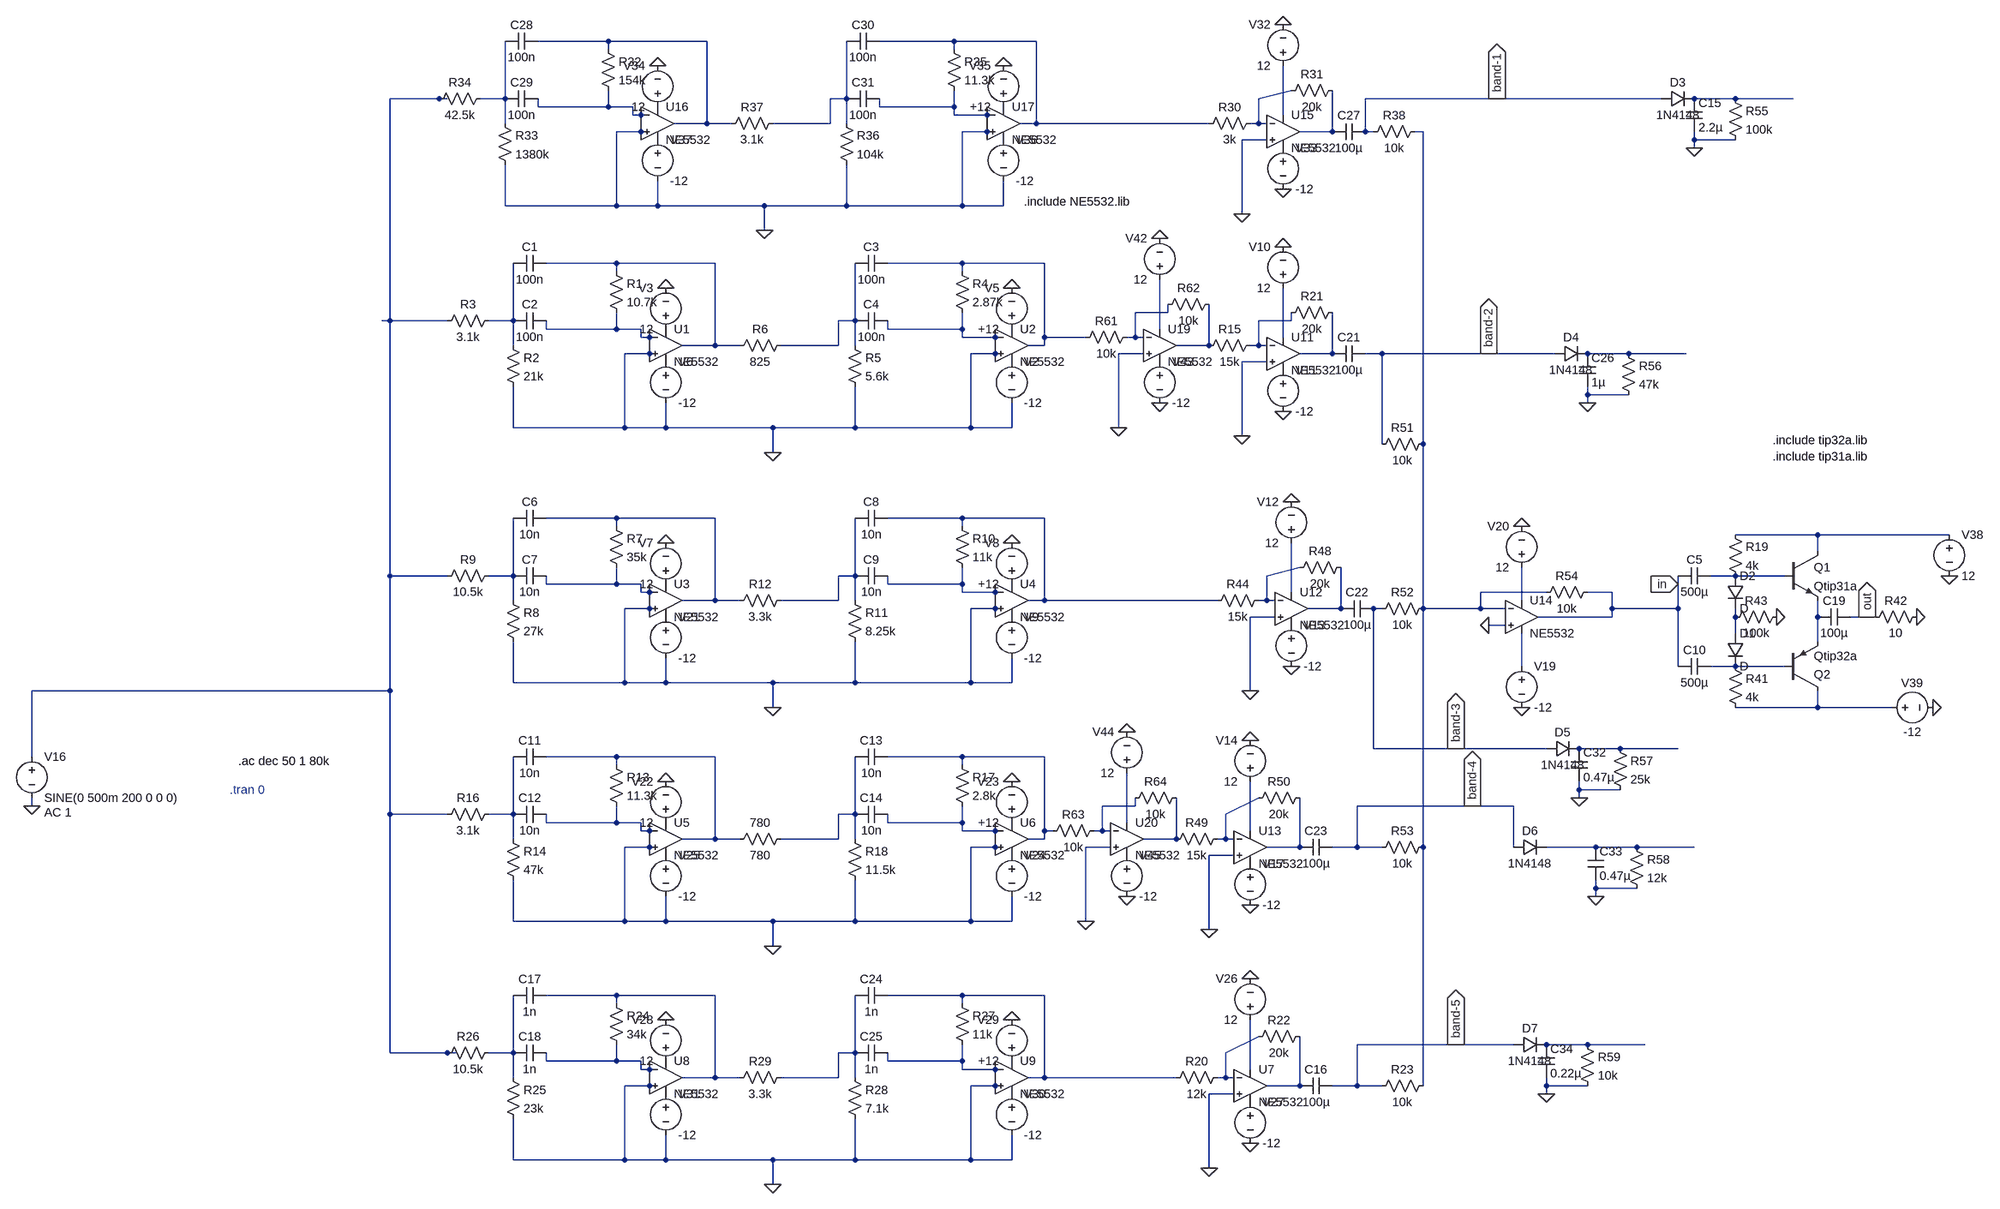
[diagram p0: schematic Equalizer 5.asc]
Equalizer 5.asc, the LTspice schematic file:
Version 4
SHEET 1 2712 2088
WIRE 16 -176 -144 -176
WIRE 208 -176 16 -176
WIRE 704 -176 544 -176
WIRE 864 -176 704 -176
WIRE 16 -160 16 -176
WIRE 704 -160 704 -176
WIRE -336 -64 -432 -64
WIRE -320 -64 -336 -64
WIRE -208 -64 -208 -176
WIRE -208 -64 -256 -64
WIRE 480 -64 480 -176
WIRE 480 -64 448 -64
WIRE 1296 -64 1360 -80
WIRE 1760 -64 1504 -64
WIRE 2080 -64 1760 -64
WIRE 2224 -64 2144 -64
WIRE 2336 -64 2224 -64
WIRE -144 -48 -144 -64
WIRE 16 -48 16 -80
WIRE 16 -48 -144 -48
WIRE 64 -48 16 -48
WIRE 544 -48 544 -64
WIRE 704 -48 704 -80
WIRE 704 -48 544 -48
WIRE 64 -32 64 -48
WIRE 80 -32 80 -48
WIRE 80 -32 64 -32
WIRE 96 -32 80 -32
WIRE 704 -32 704 -48
WIRE 768 -32 768 -48
WIRE 768 -32 704 -32
WIRE 784 -32 768 -32
WIRE 1344 -32 1344 -128
WIRE -208 -16 -208 -64
WIRE 208 -16 208 -176
WIRE 208 -16 144 -16
WIRE 256 -16 208 -16
WIRE 448 -16 448 -64
WIRE 448 -16 336 -16
WIRE 480 -16 480 -64
WIRE 864 -16 864 -176
WIRE 864 -16 832 -16
WIRE 1200 -16 864 -16
WIRE 1296 -16 1296 -64
WIRE 1296 -16 1280 -16
WIRE 1312 -16 1296 -16
WIRE 80 0 32 0
WIRE 96 0 80 0
WIRE 768 0 720 0
WIRE 784 0 768 0
WIRE 1440 0 1440 -80
WIRE 1440 0 1376 0
WIRE 1504 0 1504 -64
WIRE 1520 0 1504 0
WIRE 1616 0 1600 0
WIRE 1312 16 1264 16
WIRE 2144 16 2144 0
WIRE 2224 16 2144 16
WIRE 2144 32 2144 16
WIRE -208 144 -208 64
WIRE 32 144 32 0
WIRE 32 144 -208 144
WIRE 112 144 112 96
WIRE 112 144 32 144
WIRE 320 144 112 144
WIRE 480 144 480 64
WIRE 480 144 320 144
WIRE 720 144 720 0
WIRE 720 144 480 144
WIRE 800 144 800 96
WIRE 800 144 720 144
WIRE 1264 160 1264 16
WIRE 320 192 320 144
WIRE 32 256 -128 256
WIRE 224 256 32 256
WIRE 720 256 560 256
WIRE 880 256 720 256
WIRE 32 272 32 256
WIRE 720 272 720 256
WIRE 1120 352 1120 336
WIRE 1120 352 1056 352
WIRE -432 368 -432 -64
WIRE -432 368 -448 368
WIRE -320 368 -432 368
WIRE -192 368 -192 256
WIRE -192 368 -240 368
WIRE 496 368 496 256
WIRE 496 368 464 368
WIRE 1360 368 1360 352
WIRE 1360 368 1296 368
WIRE -128 384 -128 368
WIRE 32 384 32 352
WIRE 32 384 -128 384
WIRE 80 384 32 384
WIRE 560 384 560 368
WIRE 720 384 720 352
WIRE 720 384 560 384
WIRE 1104 384 1104 288
WIRE 80 400 80 384
WIRE 96 400 96 384
WIRE 96 400 80 400
WIRE 112 400 96 400
WIRE 720 400 720 384
WIRE 784 400 784 384
WIRE 784 400 720 400
WIRE 800 400 784 400
WIRE 880 400 880 256
WIRE 960 400 880 400
WIRE 1056 400 1056 352
WIRE 1056 400 1040 400
WIRE 1072 400 1056 400
WIRE 1344 400 1344 304
WIRE -192 416 -192 368
WIRE 224 416 224 256
WIRE 224 416 160 416
WIRE 272 416 224 416
WIRE 464 416 464 368
WIRE 464 416 352 416
WIRE 496 416 496 368
WIRE 880 416 880 400
WIRE 880 416 848 416
WIRE 1200 416 1200 336
WIRE 1200 416 1136 416
WIRE 1296 416 1296 368
WIRE 1296 416 1280 416
WIRE 1312 416 1296 416
WIRE 96 432 48 432
WIRE 112 432 96 432
WIRE 784 432 736 432
WIRE 800 432 784 432
WIRE 1072 432 1024 432
WIRE 1440 432 1440 352
WIRE 1440 432 1376 432
WIRE 1536 432 1504 432
WIRE 1744 432 1536 432
WIRE 1872 432 1744 432
WIRE 2016 432 1936 432
WIRE 2128 432 2016 432
WIRE 1312 448 1264 448
WIRE 1936 512 1936 496
WIRE 2016 512 1936 512
WIRE 1936 528 1936 512
WIRE -192 576 -192 496
WIRE 48 576 48 432
WIRE 48 576 -192 576
WIRE 128 576 128 528
WIRE 128 576 48 576
WIRE 336 576 128 576
WIRE 496 576 496 496
WIRE 496 576 336 576
WIRE 736 576 736 432
WIRE 736 576 496 576
WIRE 816 576 816 528
WIRE 816 576 736 576
WIRE 1024 576 1024 432
WIRE 1264 592 1264 448
WIRE 1536 608 1536 432
WIRE 1616 608 1616 0
WIRE 336 624 336 576
WIRE 32 752 -128 752
WIRE 224 752 32 752
WIRE 720 752 560 752
WIRE 880 752 720 752
WIRE 32 768 32 752
WIRE 720 768 720 752
WIRE 2384 784 2224 784
WIRE 2640 784 2384 784
WIRE 2384 816 2384 784
WIRE -432 864 -432 368
WIRE -320 864 -432 864
WIRE -192 864 -192 752
WIRE -192 864 -240 864
WIRE 496 864 496 752
WIRE 496 864 464 864
WIRE 1312 864 1376 848
WIRE 2224 864 2176 864
WIRE 2320 864 2224 864
WIRE -128 880 -128 864
WIRE 32 880 32 848
WIRE 32 880 -128 880
WIRE 80 880 32 880
WIRE 560 880 560 864
WIRE 720 880 720 848
WIRE 720 880 560 880
WIRE 2112 880 2112 864
WIRE 80 896 80 880
WIRE 96 896 96 880
WIRE 96 896 80 896
WIRE 112 896 96 896
WIRE 720 896 720 880
WIRE 784 896 784 880
WIRE 784 896 720 896
WIRE 800 896 784 896
WIRE 1360 896 1360 800
WIRE 1856 896 1728 896
WIRE 1984 896 1936 896
WIRE -192 912 -192 864
WIRE 224 912 224 752
WIRE 224 912 160 912
WIRE 272 912 224 912
WIRE 464 912 464 864
WIRE 464 912 352 912
WIRE 496 912 496 864
WIRE 880 912 880 752
WIRE 880 912 848 912
WIRE 1216 912 880 912
WIRE 1312 912 1312 864
WIRE 1312 912 1296 912
WIRE 1328 912 1312 912
WIRE 1808 912 1808 848
WIRE 96 928 48 928
WIRE 112 928 96 928
WIRE 784 928 736 928
WIRE 800 928 784 928
WIRE 1456 928 1456 848
WIRE 1456 928 1392 928
WIRE 1536 928 1520 928
WIRE 1616 928 1616 608
WIRE 1728 928 1728 896
WIRE 1728 928 1616 928
WIRE 1776 928 1728 928
WIRE 1984 928 1984 896
WIRE 2112 928 2112 880
WIRE 2112 928 1984 928
WIRE 1328 944 1280 944
WIRE 1984 944 1984 928
WIRE 1984 944 1840 944
WIRE 2224 944 2224 928
WIRE 2384 944 2384 912
WIRE 2480 944 2448 944
WIRE 2496 944 2480 944
WIRE 1776 960 1744 960
WIRE 2224 976 2224 944
WIRE 2384 992 2384 944
WIRE 1808 1040 1808 976
WIRE 2112 1040 2112 928
WIRE 2224 1040 2176 1040
WIRE 2320 1040 2224 1040
WIRE -192 1072 -192 992
WIRE 48 1072 48 928
WIRE 48 1072 -192 1072
WIRE 128 1072 128 1024
WIRE 128 1072 48 1072
WIRE 336 1072 128 1072
WIRE 496 1072 496 992
WIRE 496 1072 336 1072
WIRE 736 1072 736 928
WIRE 736 1072 496 1072
WIRE 816 1072 816 1024
WIRE 816 1072 736 1072
WIRE -432 1088 -432 864
WIRE -432 1088 -1392 1088
WIRE 1280 1088 1280 944
WIRE 336 1120 336 1072
WIRE 2384 1120 2384 1088
WIRE 2384 1120 2224 1120
WIRE 2528 1120 2384 1120
WIRE 1520 1200 1520 928
WIRE 1680 1200 1520 1200
WIRE 1856 1200 1680 1200
WIRE 2000 1200 1920 1200
WIRE 2112 1200 2000 1200
WIRE -1392 1216 -1392 1088
WIRE 32 1216 -128 1216
WIRE 224 1216 32 1216
WIRE 720 1216 560 1216
WIRE 880 1216 720 1216
WIRE 32 1232 32 1216
WIRE 720 1232 720 1216
WIRE 1920 1280 1920 1264
WIRE 2000 1280 1920 1280
WIRE 1920 1296 1920 1280
WIRE -1392 1312 -1392 1296
WIRE 1056 1312 1056 1296
WIRE 1056 1312 992 1312
WIRE 1712 1312 1488 1312
WIRE 1792 1312 1712 1312
WIRE -432 1328 -432 1088
WIRE -320 1328 -432 1328
WIRE -192 1328 -192 1216
WIRE -192 1328 -240 1328
WIRE 496 1328 496 1216
WIRE 496 1328 464 1328
WIRE 1232 1328 1296 1296
WIRE -128 1344 -128 1328
WIRE 32 1344 32 1312
WIRE 32 1344 -128 1344
WIRE 80 1344 32 1344
WIRE 560 1344 560 1328
WIRE 720 1344 720 1312
WIRE 720 1344 560 1344
WIRE 1040 1344 1040 1248
WIRE 80 1360 80 1344
WIRE 96 1360 96 1344
WIRE 96 1360 80 1360
WIRE 112 1360 96 1360
WIRE 720 1360 720 1344
WIRE 784 1360 784 1344
WIRE 784 1360 720 1360
WIRE 800 1360 784 1360
WIRE 880 1360 880 1216
WIRE 896 1360 880 1360
WIRE 992 1360 992 1312
WIRE 992 1360 976 1360
WIRE 1008 1360 992 1360
WIRE 1280 1360 1280 1264
WIRE -192 1376 -192 1328
WIRE 224 1376 224 1216
WIRE 224 1376 160 1376
WIRE 272 1376 224 1376
WIRE 464 1376 464 1328
WIRE 464 1376 352 1376
WIRE 496 1376 496 1328
WIRE 880 1376 880 1360
WIRE 880 1376 848 1376
WIRE 1136 1376 1136 1296
WIRE 1136 1376 1072 1376
WIRE 1232 1376 1232 1328
WIRE 1232 1376 1216 1376
WIRE 1248 1376 1232 1376
WIRE 96 1392 48 1392
WIRE 112 1392 96 1392
WIRE 784 1392 736 1392
WIRE 800 1392 784 1392
WIRE 1008 1392 960 1392
WIRE 1376 1392 1376 1296
WIRE 1376 1392 1312 1392
WIRE 1488 1392 1488 1312
WIRE 1488 1392 1440 1392
WIRE 1536 1392 1488 1392
WIRE 1616 1392 1616 928
WIRE 1792 1392 1792 1312
WIRE 1952 1392 1856 1392
WIRE 2032 1392 1952 1392
WIRE 2144 1392 2032 1392
WIRE 1248 1408 1200 1408
WIRE 1952 1472 1952 1456
WIRE 2032 1472 1952 1472
WIRE 1952 1488 1952 1472
WIRE -192 1536 -192 1456
WIRE 48 1536 48 1392
WIRE 48 1536 -192 1536
WIRE 128 1536 128 1488
WIRE 128 1536 48 1536
WIRE 336 1536 128 1536
WIRE 496 1536 496 1456
WIRE 496 1536 336 1536
WIRE 736 1536 736 1392
WIRE 736 1536 496 1536
WIRE 816 1536 816 1488
WIRE 816 1536 736 1536
WIRE 960 1536 960 1392
WIRE 1200 1552 1200 1408
WIRE 336 1584 336 1536
WIRE 32 1680 -128 1680
WIRE 224 1680 32 1680
WIRE 720 1680 560 1680
WIRE 880 1680 720 1680
WIRE 32 1696 32 1680
WIRE 720 1696 720 1680
WIRE 1680 1776 1488 1776
WIRE 1792 1776 1680 1776
WIRE 1936 1776 1856 1776
WIRE 2048 1776 1936 1776
WIRE -432 1792 -432 1328
WIRE -320 1792 -432 1792
WIRE -304 1792 -320 1792
WIRE -192 1792 -192 1680
WIRE -192 1792 -240 1792
WIRE 496 1792 496 1680
WIRE 496 1792 464 1792
WIRE 1232 1792 1296 1760
WIRE -128 1808 -128 1792
WIRE 32 1808 32 1776
WIRE 32 1808 -128 1808
WIRE 80 1808 32 1808
WIRE 560 1808 560 1792
WIRE 720 1808 720 1776
WIRE 720 1808 560 1808
WIRE 80 1824 80 1808
WIRE 96 1824 96 1808
WIRE 96 1824 80 1824
WIRE 112 1824 96 1824
WIRE 720 1824 720 1808
WIRE 784 1824 784 1808
WIRE 784 1824 720 1824
WIRE 800 1824 784 1824
WIRE 1280 1824 1280 1728
WIRE -192 1840 -192 1792
WIRE 224 1840 224 1680
WIRE 224 1840 160 1840
WIRE 272 1840 224 1840
WIRE 464 1840 464 1792
WIRE 464 1840 352 1840
WIRE 496 1840 496 1792
WIRE 880 1840 880 1680
WIRE 880 1840 848 1840
WIRE 1136 1840 880 1840
WIRE 1232 1840 1232 1792
WIRE 1232 1840 1216 1840
WIRE 1248 1840 1232 1840
WIRE 96 1856 48 1856
WIRE 112 1856 96 1856
WIRE 784 1856 736 1856
WIRE 800 1856 784 1856
WIRE 1376 1856 1376 1760
WIRE 1376 1856 1312 1856
WIRE 1488 1856 1488 1776
WIRE 1488 1856 1440 1856
WIRE 1536 1856 1488 1856
WIRE 1616 1856 1616 1392
WIRE 1856 1856 1856 1840
WIRE 1936 1856 1856 1856
WIRE 1248 1872 1200 1872
WIRE 1856 1872 1856 1856
WIRE -192 2000 -192 1920
WIRE 48 2000 48 1856
WIRE 48 2000 -192 2000
WIRE 128 2000 128 1952
WIRE 128 2000 48 2000
WIRE 336 2000 128 2000
WIRE 496 2000 496 1920
WIRE 496 2000 336 2000
WIRE 736 2000 736 1856
WIRE 736 2000 496 2000
WIRE 816 2000 816 1952
WIRE 816 2000 736 2000
WIRE 1200 2016 1200 1872
WIRE 336 2048 336 2000
FLAG -1392 1312 0
FLAG 1264 592 0
FLAG 1344 544 0
FLAG 1344 224 0
FLAG 1280 1088 0
FLAG 1360 1040 0
FLAG 1360 720 0
FLAG 1200 1552 0
FLAG 1280 1504 0
FLAG 1280 1184 0
FLAG 1808 1120 0
FLAG 1808 768 0
FLAG 1744 960 0
FLAG 336 624 0
FLAG 128 304 0
FLAG 816 304 0
FLAG 336 1120 0
FLAG 128 800 0
FLAG 816 800 0
FLAG 336 1584 0
FLAG 128 1264 0
FLAG 816 1264 0
FLAG 1200 2016 0
FLAG 1280 1968 0
FLAG 1280 1648 0
FLAG 336 2048 0
FLAG 128 1728 0
FLAG 816 1728 0
FLAG 1264 160 0
FLAG 1344 112 0
FLAG 1344 -208 0
FLAG 320 192 0
FLAG 112 -128 0
FLAG 800 -128 0
FLAG 2640 864 0
FLAG 2608 1120 0
FLAG 2304 944 0
FLAG 2576 944 0
FLAG 2112 880 in
IOPIN 2112 880 In
FLAG 2480 944 out
IOPIN 2480 944 Out
FLAG 2144 32 0
FLAG 1936 528 0
FLAG 1920 1296 0
FLAG 1952 1488 0
FLAG 1856 1872 0
FLAG 1024 576 0
FLAG 1104 528 0
FLAG 1104 208 0
FLAG 960 1536 0
FLAG 1040 1488 0
FLAG 1040 1168 0
FLAG 1760 -64 band-1
IOPIN 1760 -64 Out
FLAG 1744 432 band-2
IOPIN 1744 432 Out
FLAG 1680 1200 band-3
IOPIN 1680 1200 Out
FLAG 1712 1312 band-4
IOPIN 1712 1312 Out
FLAG 1680 1776 band-5
IOPIN 1680 1776 Out
SYMBOL voltage -1392 1200 R0
WINDOW 123 24 124 Left 2
WINDOW 39 0 0 Left 0
SYMATTR Value2 AC 1
SYMATTR InstName V16
SYMATTR Value SINE(0 500m 200 0 0 0)
SYMBOL res 1296 400 R90
WINDOW 0 0 56 VBottom 2
WINDOW 3 32 56 VTop 2
SYMATTR InstName R15
SYMATTR Value 15k
SYMBOL voltage 1344 320 R180
WINDOW 0 24 96 Left 2
WINDOW 3 24 16 Left 2
WINDOW 123 0 0 Left 0
WINDOW 39 0 0 Left 0
SYMATTR InstName V10
SYMATTR Value 12
SYMBOL voltage 1344 448 R0
WINDOW 123 0 0 Left 0
WINDOW 39 0 0 Left 0
SYMATTR InstName V11
SYMATTR Value -12
SYMBOL OpAmps\\opamp2 1344 368 R0
SYMATTR InstName U11
SYMATTR Value NE5532
SYMBOL res 1312 896 R90
WINDOW 0 0 56 VBottom 2
WINDOW 3 32 56 VTop 2
SYMATTR InstName R44
SYMATTR Value 15k
SYMBOL voltage 1360 816 R180
WINDOW 0 24 96 Left 2
WINDOW 3 24 16 Left 2
WINDOW 123 0 0 Left 0
WINDOW 39 0 0 Left 0
SYMATTR InstName V12
SYMATTR Value 12
SYMBOL voltage 1360 944 R0
WINDOW 123 0 0 Left 0
WINDOW 39 0 0 Left 0
SYMATTR InstName V13
SYMATTR Value -12
SYMBOL OpAmps\\opamp2 1360 864 R0
SYMATTR InstName U12
SYMATTR Value NE5532
SYMBOL res 1472 832 R90
WINDOW 0 0 56 VBottom 2
WINDOW 3 32 56 VTop 2
SYMATTR InstName R48
SYMATTR Value 20k
SYMBOL res 1232 1360 R90
WINDOW 0 0 56 VBottom 2
WINDOW 3 32 56 VTop 2
SYMATTR InstName R49
SYMATTR Value 15k
SYMBOL voltage 1280 1280 R180
WINDOW 0 24 96 Left 2
WINDOW 3 24 16 Left 2
WINDOW 123 0 0 Left 0
WINDOW 39 0 0 Left 0
SYMATTR InstName V14
SYMATTR Value 12
SYMBOL voltage 1280 1408 R0
WINDOW 123 0 0 Left 0
WINDOW 39 0 0 Left 0
SYMATTR InstName V17
SYMATTR Value -12
SYMBOL OpAmps\\opamp2 1280 1328 R0
SYMATTR InstName U13
SYMATTR Value NE5532
SYMBOL res 1392 1280 R90
WINDOW 0 0 56 VBottom 2
WINDOW 3 32 56 VTop 2
SYMATTR InstName R50
SYMATTR Value 20k
SYMBOL res 1456 336 R90
WINDOW 0 0 56 VBottom 2
WINDOW 3 32 56 VTop 2
SYMATTR InstName R21
SYMATTR Value 20k
SYMBOL cap 1504 416 R90
WINDOW 0 0 32 VBottom 2
WINDOW 3 32 32 VTop 2
SYMATTR InstName C21
SYMATTR Value 100µ
SYMBOL cap 1520 912 R90
WINDOW 0 0 32 VBottom 2
WINDOW 3 32 32 VTop 2
SYMATTR InstName C22
SYMATTR Value 100µ
SYMBOL cap 1440 1376 R90
WINDOW 0 0 32 VBottom 2
WINDOW 3 32 32 VTop 2
SYMATTR InstName C23
SYMATTR Value 100µ
SYMBOL res 1632 592 R90
WINDOW 0 0 56 VBottom 2
WINDOW 3 32 56 VTop 2
SYMATTR InstName R51
SYMATTR Value 10k
SYMBOL res 1632 912 R90
WINDOW 0 0 56 VBottom 2
WINDOW 3 32 56 VTop 2
SYMATTR InstName R52
SYMATTR Value 10k
SYMBOL res 1632 1376 R90
WINDOW 0 0 56 VBottom 2
WINDOW 3 32 56 VTop 2
SYMATTR InstName R53
SYMATTR Value 10k
SYMBOL OpAmps\\opamp2 1808 880 R0
SYMATTR InstName U14
SYMATTR Value NE5532
SYMBOL voltage 1808 1024 R0
WINDOW 123 0 0 Left 0
WINDOW 39 0 0 Left 0
SYMATTR InstName V19
SYMATTR Value -12
SYMBOL voltage 1808 864 R180
WINDOW 0 24 96 Left 2
WINDOW 3 24 16 Left 2
WINDOW 123 0 0 Left 0
WINDOW 39 0 0 Left 0
SYMATTR InstName V20
SYMATTR Value 12
SYMBOL res 1952 880 R90
WINDOW 0 0 56 VBottom 2
WINDOW 3 32 56 VTop 2
SYMATTR InstName R54
SYMATTR Value 10k
SYMBOL res 16 256 R0
SYMATTR InstName R1
SYMATTR Value 10.7k
SYMBOL cap -128 240 R90
WINDOW 0 0 32 VBottom 2
WINDOW 3 32 32 VTop 2
SYMATTR InstName C1
SYMATTR Value 100n
SYMBOL cap -128 352 R90
WINDOW 0 0 32 VBottom 2
WINDOW 3 32 32 VTop 2
SYMATTR InstName C2
SYMATTR Value 100n
SYMBOL res -208 400 R0
SYMATTR InstName R2
SYMATTR Value 21k
SYMBOL res 704 256 R0
SYMATTR InstName R4
SYMATTR Value 2.87k
SYMBOL cap 560 240 R90
WINDOW 0 0 32 VBottom 2
WINDOW 3 32 32 VTop 2
SYMATTR InstName C3
SYMATTR Value 100n
SYMBOL cap 560 352 R90
WINDOW 0 0 32 VBottom 2
WINDOW 3 32 32 VTop 2
SYMATTR InstName C4
SYMATTR Value 100n
SYMBOL res 480 400 R0
SYMATTR InstName R5
SYMATTR Value 5.6k
SYMBOL res 368 400 R90
WINDOW 0 0 56 VBottom 2
WINDOW 3 32 56 VTop 2
SYMATTR InstName R6
SYMATTR Value 825
SYMBOL voltage 128 400 R180
WINDOW 0 24 96 Left 2
WINDOW 3 24 16 Left 2
WINDOW 123 0 0 Left 0
WINDOW 39 0 0 Left 0
SYMATTR InstName V3
SYMATTR Value 12
SYMBOL voltage 816 400 R180
WINDOW 0 24 96 Left 2
WINDOW 3 24 16 Left 2
WINDOW 123 0 0 Left 0
WINDOW 39 24 68 Left 2
SYMATTR InstName V5
SYMATTR Value +12
SYMBOL OpAmps\\opamp2 128 352 R0
SYMATTR InstName U1
SYMATTR Value NE5532
SYMBOL OpAmps\\opamp2 816 352 R0
SYMATTR InstName U2
SYMATTR Value NE5532
SYMBOL voltage 816 432 R0
WINDOW 123 0 0 Left 0
WINDOW 39 0 0 Left 0
SYMATTR InstName V2
SYMATTR Value -12
SYMBOL voltage 128 432 R0
WINDOW 123 0 0 Left 0
WINDOW 39 0 0 Left 0
SYMATTR InstName V6
SYMATTR Value -12
SYMBOL res 16 752 R0
SYMATTR InstName R7
SYMATTR Value 35k
SYMBOL cap -128 736 R90
WINDOW 0 0 32 VBottom 2
WINDOW 3 32 32 VTop 2
SYMATTR InstName C6
SYMATTR Value 10n
SYMBOL cap -128 848 R90
WINDOW 0 0 32 VBottom 2
WINDOW 3 32 32 VTop 2
SYMATTR InstName C7
SYMATTR Value 10n
SYMBOL res -208 896 R0
SYMATTR InstName R8
SYMATTR Value 27k
SYMBOL res -224 848 R90
WINDOW 0 0 56 VBottom 2
WINDOW 3 32 56 VTop 2
SYMATTR InstName R9
SYMATTR Value 10.5k
SYMBOL res 704 752 R0
SYMATTR InstName R10
SYMATTR Value 11k
SYMBOL cap 560 736 R90
WINDOW 0 0 32 VBottom 2
WINDOW 3 32 32 VTop 2
SYMATTR InstName C8
SYMATTR Value 10n
SYMBOL cap 560 848 R90
WINDOW 0 0 32 VBottom 2
WINDOW 3 32 32 VTop 2
SYMATTR InstName C9
SYMATTR Value 10n
SYMBOL res 480 896 R0
SYMATTR InstName R11
SYMATTR Value 8.25k
SYMBOL res 368 896 R90
WINDOW 0 0 56 VBottom 2
WINDOW 3 32 56 VTop 2
SYMATTR InstName R12
SYMATTR Value 3.3k
SYMBOL voltage 128 896 R180
WINDOW 0 24 96 Left 2
WINDOW 3 24 16 Left 2
WINDOW 123 0 0 Left 0
WINDOW 39 0 0 Left 0
SYMATTR InstName V7
SYMATTR Value 12
SYMBOL voltage 816 896 R180
WINDOW 0 24 96 Left 2
WINDOW 3 24 16 Left 2
WINDOW 123 0 0 Left 0
WINDOW 39 24 68 Left 2
SYMATTR InstName V8
SYMATTR Value +12
SYMBOL OpAmps\\opamp2 128 848 R0
SYMATTR InstName U3
SYMATTR Value NE5532
SYMBOL OpAmps\\opamp2 816 848 R0
SYMATTR InstName U4
SYMATTR Value NE5532
SYMBOL voltage 816 928 R0
WINDOW 123 0 0 Left 0
WINDOW 39 0 0 Left 0
SYMATTR InstName V9
SYMATTR Value -12
SYMBOL voltage 128 928 R0
WINDOW 123 0 0 Left 0
WINDOW 39 0 0 Left 0
SYMATTR InstName V21
SYMATTR Value -12
SYMBOL res 16 1216 R0
SYMATTR InstName R13
SYMATTR Value 11.3k
SYMBOL cap -128 1200 R90
WINDOW 0 0 32 VBottom 2
WINDOW 3 32 32 VTop 2
SYMATTR InstName C11
SYMATTR Value 10n
SYMBOL cap -128 1312 R90
WINDOW 0 0 32 VBottom 2
WINDOW 3 32 32 VTop 2
SYMATTR InstName C12
SYMATTR Value 10n
SYMBOL res -208 1360 R0
SYMATTR InstName R14
SYMATTR Value 47k
SYMBOL res -224 1312 R90
WINDOW 0 0 56 VBottom 2
WINDOW 3 32 56 VTop 2
SYMATTR InstName R16
SYMATTR Value 3.1k
SYMBOL res 704 1216 R0
SYMATTR InstName R17
SYMATTR Value 2.8k
SYMBOL cap 560 1200 R90
WINDOW 0 0 32 VBottom 2
WINDOW 3 32 32 VTop 2
SYMATTR InstName C13
SYMATTR Value 10n
SYMBOL cap 560 1312 R90
WINDOW 0 0 32 VBottom 2
WINDOW 3 32 32 VTop 2
SYMATTR InstName C14
SYMATTR Value 10n
SYMBOL res 480 1360 R0
SYMATTR InstName R18
SYMATTR Value 11.5k
SYMBOL res 368 1360 R90
WINDOW 0 0 56 VBottom 2
WINDOW 3 32 56 VTop 2
SYMATTR InstName 780
SYMATTR Value 780
SYMBOL voltage 128 1360 R180
WINDOW 0 24 96 Left 2
WINDOW 3 24 16 Left 2
WINDOW 123 0 0 Left 0
WINDOW 39 0 0 Left 0
SYMATTR InstName V22
SYMATTR Value 12
SYMBOL voltage 816 1360 R180
WINDOW 0 24 96 Left 2
WINDOW 3 24 16 Left 2
WINDOW 123 0 0 Left 0
WINDOW 39 24 68 Left 2
SYMATTR InstName V23
SYMATTR Value +12
SYMBOL OpAmps\\opamp2 128 1312 R0
SYMATTR InstName U5
SYMATTR Value NE5532
SYMBOL OpAmps\\opamp2 816 1312 R0
SYMATTR InstName U6
SYMATTR Value NE5532
SYMBOL voltage 816 1392 R0
WINDOW 123 0 0 Left 0
WINDOW 39 0 0 Left 0
SYMATTR InstName V24
SYMATTR Value -12
SYMBOL voltage 128 1392 R0
WINDOW 123 0 0 Left 0
WINDOW 39 0 0 Left 0
SYMATTR InstName V25
SYMATTR Value -12
SYMBOL res 1232 1824 R90
WINDOW 0 0 56 VBottom 2
WINDOW 3 32 56 VTop 2
SYMATTR InstName R20
SYMATTR Value 12k
SYMBOL voltage 1280 1744 R180
WINDOW 0 24 96 Left 2
WINDOW 3 24 16 Left 2
WINDOW 123 0 0 Left 0
WINDOW 39 0 0 Left 0
SYMATTR InstName V26
SYMATTR Value 12
SYMBOL voltage 1280 1872 R0
WINDOW 123 0 0 Left 0
WINDOW 39 0 0 Left 0
SYMATTR InstName V27
SYMATTR Value -12
SYMBOL OpAmps\\opamp2 1280 1792 R0
SYMATTR InstName U7
SYMATTR Value NE5532
SYMBOL res 1392 1744 R90
WINDOW 0 0 56 VBottom 2
WINDOW 3 32 56 VTop 2
SYMATTR InstName R22
SYMATTR Value 20k
SYMBOL cap 1440 1840 R90
WINDOW 0 0 32 VBottom 2
WINDOW 3 32 32 VTop 2
SYMATTR InstName C16
SYMATTR Value 100µ
SYMBOL res 1632 1840 R90
WINDOW 0 0 56 VBottom 2
WINDOW 3 32 56 VTop 2
SYMATTR InstName R23
SYMATTR Value 10k
SYMBOL res 16 1680 R0
SYMATTR InstName R24
SYMATTR Value 34k
SYMBOL cap -128 1664 R90
WINDOW 0 0 32 VBottom 2
WINDOW 3 32 32 VTop 2
SYMATTR InstName C17
SYMATTR Value 1n
SYMBOL cap -128 1776 R90
WINDOW 0 0 32 VBottom 2
WINDOW 3 32 32 VTop 2
SYMATTR InstName C18
SYMATTR Value 1n
SYMBOL res -208 1824 R0
SYMATTR InstName R25
SYMATTR Value 23k
SYMBOL res -224 1776 R90
WINDOW 0 0 56 VBottom 2
WINDOW 3 32 56 VTop 2
SYMATTR InstName R26
SYMATTR Value 10.5k
SYMBOL res 704 1680 R0
SYMATTR InstName R27
SYMATTR Value 11k
SYMBOL cap 560 1664 R90
WINDOW 0 0 32 VBottom 2
WINDOW 3 32 32 VTop 2
SYMATTR InstName C24
SYMATTR Value 1n
SYMBOL cap 560 1776 R90
WINDOW 0 0 32 VBottom 2
WINDOW 3 32 32 VTop 2
SYMATTR InstName C25
SYMATTR Value 1n
SYMBOL res 480 1824 R0
SYMATTR InstName R28
SYMATTR Value 7.1k
SYMBOL res 368 1824 R90
WINDOW 0 0 56 VBottom 2
WINDOW 3 32 56 VTop 2
SYMATTR InstName R29
SYMATTR Value 3.3k
SYMBOL voltage 128 1824 R180
WINDOW 0 24 96 Left 2
WINDOW 3 24 16 Left 2
WINDOW 123 0 0 Left 0
WINDOW 39 0 0 Left 0
SYMATTR InstName V28
SYMATTR Value 12
SYMBOL voltage 816 1824 R180
WINDOW 0 24 96 Left 2
WINDOW 3 24 16 Left 2
WINDOW 123 0 0 Left 0
WINDOW 39 24 68 Left 2
SYMATTR InstName V29
SYMATTR Value +12
SYMBOL OpAmps\\opamp2 128 1776 R0
SYMATTR InstName U8
SYMATTR Value NE5532
SYMBOL OpAmps\\opamp2 816 1776 R0
SYMATTR InstName U9
SYMATTR Value NE5532
SYMBOL voltage 816 1856 R0
WINDOW 123 0 0 Left 0
WINDOW 39 0 0 Left 0
SYMATTR InstName V30
SYMATTR Value -12
SYMBOL voltage 128 1856 R0
WINDOW 123 0 0 Left 0
WINDOW 39 0 0 Left 0
SYMATTR InstName V31
SYMATTR Value -12
SYMBOL res 1296 -32 R90
WINDOW 0 0 56 VBottom 2
WINDOW 3 32 56 VTop 2
SYMATTR InstName R30
SYMATTR Value 3k
SYMBOL voltage 1344 -112 R180
WINDOW 0 24 96 Left 2
WINDOW 3 24 16 Left 2
WINDOW 123 0 0 Left 0
WINDOW 39 0 0 Left 0
SYMATTR InstName V32
SYMATTR Value 12
SYMBOL voltage 1344 16 R0
WINDOW 123 0 0 Left 0
WINDOW 39 0 0 Left 0
SYMATTR InstName V33
SYMATTR Value -12
SYMBOL OpAmps\\opamp2 1344 -64 R0
SYMATTR InstName U15
SYMATTR Value NE5532
SYMBOL res 1456 -96 R90
WINDOW 0 0 56 VBottom 2
WINDOW 3 32 56 VTop 2
SYMATTR InstName R31
SYMATTR Value 20k
SYMBOL cap 1504 -16 R90
WINDOW 0 0 32 VBottom 2
WINDOW 3 32 32 VTop 2
SYMATTR InstName C27
SYMATTR Value 100µ
SYMBOL res 0 -176 R0
SYMATTR InstName R32
SYMATTR Value 154k
SYMBOL cap -144 -192 R90
WINDOW 0 0 32 VBottom 2
WINDOW 3 32 32 VTop 2
SYMATTR InstName C28
SYMATTR Value 100n
SYMBOL cap -144 -80 R90
WINDOW 0 0 32 VBottom 2
WINDOW 3 32 32 VTop 2
SYMATTR InstName C29
SYMATTR Value 100n
SYMBOL res -224 -32 R0
SYMATTR InstName R33
SYMATTR Value 1380k
SYMBOL res -240 -80 R90
WINDOW 0 0 56 VBottom 2
WINDOW 3 32 56 VTop 2
SYMATTR InstName R34
SYMATTR Value 42.5k
SYMBOL res 688 -176 R0
SYMATTR InstName R35
SYMATTR Value 11.3k
SYMBOL cap 544 -192 R90
WINDOW 0 0 32 VBottom 2
WINDOW 3 32 32 VTop 2
SYMATTR InstName C30
SYMATTR Value 100n
SYMBOL cap 544 -80 R90
WINDOW 0 0 32 VBottom 2
WINDOW 3 32 32 VTop 2
SYMATTR InstName C31
SYMATTR Value 100n
SYMBOL res 464 -32 R0
SYMATTR InstName R36
SYMATTR Value 104k
SYMBOL res 352 -32 R90
WINDOW 0 0 56 VBottom 2
WINDOW 3 32 56 VTop 2
SYMATTR InstName R37
SYMATTR Value 3.1k
SYMBOL voltage 112 -32 R180
WINDOW 0 24 96 Left 2
WINDOW 3 24 16 Left 2
WINDOW 123 0 0 Left 0
WINDOW 39 0 0 Left 0
SYMATTR InstName V34
SYMATTR Value 12
SYMBOL voltage 800 -32 R180
WINDOW 0 24 96 Left 2
WINDOW 3 24 16 Left 2
WINDOW 123 0 0 Left 0
WINDOW 39 24 68 Left 2
SYMATTR InstName V35
SYMATTR Value +12
SYMBOL OpAmps\\opamp2 112 -80 R0
SYMATTR InstName U16
SYMATTR Value NE5532
SYMBOL OpAmps\\opamp2 800 -80 R0
SYMATTR InstName U17
SYMATTR Value NE5532
SYMBOL voltage 800 0 R0
WINDOW 123 0 0 Left 0
WINDOW 39 0 0 Left 0
SYMATTR InstName V36
SYMATTR Value -12
SYMBOL voltage 112 0 R0
WINDOW 123 0 0 Left 0
WINDOW 39 0 0 Left 0
SYMATTR InstName V37
SYMATTR Value -12
SYMBOL res 1616 -16 R90
WINDOW 0 0 56 VBottom 2
WINDOW 3 32 56 VTop 2
SYMATTR InstName R38
SYMATTR Value 10k
SYMBOL res -224 352 R90
WINDOW 0 0 56 VBottom 2
WINDOW 3 32 56 VTop 2
SYMATTR InstName R3
SYMATTR Value 3.1k
SYMBOL cap 2176 848 R90
WINDOW 0 0 32 VBottom 2
WINDOW 3 32 32 VTop 2
SYMATTR InstName C5
SYMATTR Value 500µ
SYMBOL cap 2176 1024 R90
WINDOW 0 0 32 VBottom 2
WINDOW 3 32 32 VTop 2
SYMATTR InstName C10
SYMATTR Value 500µ
SYMBOL res 2208 768 R0
SYMATTR InstName R19
SYMATTR Value 4k
SYMBOL res 2208 1024 R0
SYMATTR InstName R41
SYMATTR Value 4k
SYMBOL npn 2320 816 R0
SYMATTR InstName Q1
SYMATTR Value Qtip31a
SYMBOL pnp 2320 1088 M180
SYMATTR InstName Q2
SYMATTR Value Qtip32a
SYMBOL res 2592 928 R90
WINDOW 0 0 56 VBottom 2
WINDOW 3 32 56 VTop 2
SYMATTR InstName R42
SYMATTR Value 10
SYMBOL voltage 2640 768 R0
WINDOW 123 0 0 Left 0
WINDOW 39 0 0 Left 0
SYMATTR InstName V38
SYMATTR Value 12
SYMBOL voltage 2512 1120 R270
WINDOW 0 32 56 VTop 2
WINDOW 3 -32 56 VBottom 2
WINDOW 123 0 0 Left 0
WINDOW 39 0 0 Left 0
SYMATTR InstName V39
SYMATTR Value -12
SYMBOL diode 2208 976 R0
SYMATTR InstName D1
SYMBOL diode 2208 864 R0
SYMATTR InstName D2
SYMBOL res 2320 928 R90
WINDOW 0 0 56 VBottom 2
WINDOW 3 32 56 VTop 2
SYMATTR InstName R43
SYMATTR Value 100k
SYMBOL diode 2080 -48 R270
WINDOW 0 32 32 VTop 2
WINDOW 3 0 32 VBottom 2
SYMATTR InstName D3
SYMATTR Value 1N4148
SYMBOL cap 2128 -64 R0
SYMATTR InstName C15
SYMATTR Value 2.2µ
SYMBOL res 2208 -80 R0
SYMATTR InstName R55
SYMATTR Value 100k
SYMBOL diode 1872 448 R270
WINDOW 0 32 32 VTop 2
WINDOW 3 0 32 VBottom 2
SYMATTR InstName D4
SYMATTR Value 1N4148
SYMBOL cap 1920 432 R0
SYMATTR InstName C26
SYMATTR Value 1µ
SYMBOL res 2000 416 R0
SYMATTR InstName R56
SYMATTR Value 47k
SYMBOL diode 1856 1216 R270
WINDOW 0 32 32 VTop 2
WINDOW 3 0 32 VBottom 2
SYMATTR InstName D5
SYMATTR Value 1N4148
SYMBOL cap 1904 1200 R0
SYMATTR InstName C32
SYMATTR Value 0.47µ
SYMBOL res 1984 1184 R0
SYMATTR InstName R57
SYMATTR Value 25k
SYMBOL diode 1792 1408 R270
WINDOW 0 32 32 VTop 2
WINDOW 3 0 32 VBottom 2
SYMATTR InstName D6
SYMATTR Value 1N4148
SYMBOL res 2016 1376 R0
SYMATTR InstName R58
SYMATTR Value 12k
SYMBOL diode 1792 1792 R270
WINDOW 0 32 32 VTop 2
WINDOW 3 0 32 VBottom 2
SYMATTR InstName D7
SYMATTR Value 1N4148
SYMBOL cap 1840 1776 R0
SYMATTR InstName C34
SYMATTR Value 0.22µ
SYMBOL res 1920 1760 R0
SYMATTR InstName R59
SYMATTR Value 10k
SYMBOL cap 1936 1392 R0
SYMATTR InstName C33
SYMATTR Value 0.47µ
SYMBOL res 1056 384 R90
WINDOW 0 0 56 VBottom 2
WINDOW 3 32 56 VTop 2
SYMATTR InstName R61
SYMATTR Value 10k
SYMBOL voltage 1104 304 R180
WINDOW 0 24 96 Left 2
WINDOW 3 24 16 Left 2
WINDOW 123 0 0 Left 0
WINDOW 39 0 0 Left 0
SYMATTR InstName V42
SYMATTR Value 12
SYMBOL voltage 1104 432 R0
WINDOW 123 0 0 Left 0
WINDOW 39 0 0 Left 0
SYMATTR InstName V43
SYMATTR Value -12
SYMBOL OpAmps\\opamp2 1104 352 R0
SYMATTR InstName U19
SYMATTR Value NE5532
SYMBOL res 1216 320 R90
WINDOW 0 0 56 VBottom 2
WINDOW 3 32 56 VTop 2
SYMATTR InstName R62
SYMATTR Value 10k
SYMBOL res 992 1344 R90
WINDOW 0 0 56 VBottom 2
WINDOW 3 32 56 VTop 2
SYMATTR InstName R63
SYMATTR Value 10k
SYMBOL voltage 1040 1264 R180
WINDOW 0 24 96 Left 2
WINDOW 3 24 16 Left 2
WINDOW 123 0 0 Left 0
WINDOW 39 0 0 Left 0
SYMATTR InstName V44
SYMATTR Value 12
SYMBOL voltage 1040 1392 R0
WINDOW 123 0 0 Left 0
WINDOW 39 0 0 Left 0
SYMATTR InstName V45
SYMATTR Value -12
SYMBOL OpAmps\\opamp2 1040 1312 R0
SYMATTR InstName U20
SYMATTR Value NE5532
SYMBOL res 1152 1280 R90
WINDOW 0 0 56 VBottom 2
WINDOW 3 32 56 VTop 2
SYMATTR InstName R64
SYMATTR Value 10k
SYMBOL cap 2448 928 R90
WINDOW 0 0 32 VBottom 2
WINDOW 3 32 32 VTop 2
SYMATTR InstName C19
SYMATTR Value 100µ
TEXT 840 136 Left 2 !.include NE5532.lib
TEXT 2296 632 Left 2 !.include tip31a.lib
TEXT 2296 600 Left 2 !.include tip32a.lib
TEXT -760 1280 Left 2 ;.tran 0
TEXT -744 1224 Left 2 !.ac dec 50 1 80k

The netlist it stands for:
* Equalizer 5.asc
V16 N003 0 SINE(0 500m 200 0 0 0) AC 1
R15 N018 N023 15k
V10 N022 0 12
V11 P001 0 -12
XU11 0 N018 N022 P001 N024 NE5532  ; pins In+ In- V+ V- OUT
R44 N031 N027 15k
V12 N035 0 12
V13 P002 0 -12
XU12 0 N031 N035 P002 N037 NE5532  ; pins In+ In- V+ V- OUT
R48 N037 N031 20k
R49 N049 N054 15k
V14 N053 0 12
V17 P003 0 -12
XU13 0 N049 N053 P003 N055 NE5532  ; pins In+ In- V+ V- OUT
R50 N055 N049 20k
R21 N024 N018 20k
C21 band-2 N024 100µ
C22 band-3 N037 100µ
C23 band-4 N055 100µ
R51 N012 band-2 10k
R52 N012 band-3 10k
R53 N012 band-4 10k
XU14 0 N012 N036 N040 in NE5532  ; pins In+ In- V+ V- OUT
V19 N040 0 -12
V20 N036 0 12
R54 in N012 10k
R1 N013 N019 10.7k
C1 N013 N016 100n
C2 N019 N016 100n
R2 N016 0 21k
R4 N014 N020 2.87k
C3 N014 N017 100n
C4 N020 N017 100n
R5 N017 0 5.6k
R6 N017 N013 825
V3 P004 0 12
V5 P005 0 +12
XU1 0 N019 P004 P006 N013 NE5532  ; pins In+ In- V+ V- OUT
XU2 0 N020 P005 P007 N014 NE5532  ; pins In+ In- V+ V- OUT
V2 P007 0 -12
V6 P006 0 -12
R7 N026 N033 35k
C6 N026 N029 10n
C7 N033 N029 10n
R8 N029 0 27k
R9 N029 N003 10.5k
R10 N027 N034 11k
C8 N027 N030 10n
C9 N034 N030 10n
R11 N030 0 8.25k
R12 N030 N026 3.3k
V7 P008 0 12
V8 P009 0 +12
XU3 0 N033 P008 P010 N026 NE5532  ; pins In+ In- V+ V- OUT
XU4 0 N034 P009 P011 N027 NE5532  ; pins In+ In- V+ V- OUT
V9 P011 0 -12
V21 P010 0 -12
R13 N044 N050 11.3k
C11 N044 N047 10n
C12 N050 N047 10n
R14 N047 0 47k
R16 N047 N003 3.1k
R17 N045 N051 2.8k
C13 N045 N048 10n
C14 N051 N048 10n
R18 N048 0 11.5k
R§780 N048 N044 780
V22 P012 0 12
V23 P013 0 +12
XU5 0 N050 P012 P014 N044 NE5532  ; pins In+ In- V+ V- OUT
XU6 0 N051 P013 P015 N045 NE5532  ; pins In+ In- V+ V- OUT
V24 P015 0 -12
V25 P014 0 -12
R20 N062 N058 12k
V26 N065 0 12
V27 P016 0 -12
XU7 0 N062 N065 P016 N066 NE5532  ; pins In+ In- V+ V- OUT
R22 N066 N062 20k
C16 band-5 N066 100µ
R23 N012 band-5 10k
R24 N057 N063 34k
C17 N057 N060 1n
C18 N063 N060 1n
R25 N060 0 23k
R26 N060 N003 10.5k
R27 N058 N064 11k
C24 N058 N061 1n
C25 N064 N061 1n
R28 N061 0 7.1k
R29 N061 N057 3.3k
V28 P017 0 12
V29 P018 0 +12
XU8 0 N063 P017 P019 N057 NE5532  ; pins In+ In- V+ V- OUT
XU9 0 N064 P018 P020 N058 NE5532  ; pins In+ In- V+ V- OUT
V30 P020 0 -12
V31 P019 0 -12
R30 N006 N002 3k
V32 N010 0 12
V33 P021 0 -12
XU15 0 N006 N010 P021 N011 NE5532  ; pins In+ In- V+ V- OUT
R31 N011 N006 20k
C27 band-1 N011 100µ
R32 N001 N008 154k
C28 N001 N004 100n
C29 N008 N004 100n
R33 N004 0 1380k
R34 N004 N003 42.5k
R35 N002 N009 11.3k
C30 N002 N005 100n
C31 N009 N005 100n
R36 N005 0 104k
R37 N005 N001 3.1k
V34 P022 0 12
V35 P023 0 +12
XU16 0 N008 P022 P024 N001 NE5532  ; pins In+ In- V+ V- OUT
XU17 0 N009 P023 P025 N002 NE5532  ; pins In+ In- V+ V- OUT
V36 P025 0 -12
V37 P024 0 -12
R38 N012 band-1 10k
R3 N016 N003 3.1k
C5 N032 in 500µ
C10 N041 in 500µ
R19 N028 N032 4k
R41 N041 N042 4k
Q1 N028 N032 N039 0 Qtip31a
Q2 N042 N041 N039 0 Qtip32a
R42 0 out 10
V38 N028 0 12
V39 N042 0 -12
D1 N038 N041 D
D2 N032 N038 D
R43 0 N038 100k
D3 band-1 N007 1N4148
C15 N007 0 2.2µ
R55 N007 0 100k
D4 band-2 N025 1N4148
C26 N025 0 1µ
R56 N025 0 47k
D5 band-3 N043 1N4148
C32 N043 0 0.47µ
R57 N043 0 25k
D6 band-4 N056 1N4148
R58 N056 0 12k
D7 band-5 N059 1N4148
C34 N059 0 0.22µ
R59 N059 0 10k
C33 N056 0 0.47µ
R61 N015 N014 10k
V42 N021 0 12
V43 P026 0 -12
XU19 0 N015 N021 P026 N023 NE5532  ; pins In+ In- V+ V- OUT
R62 N023 N015 10k
R63 N046 N045 10k
V44 N052 0 12
V45 P027 0 -12
XU20 0 N046 N052 P027 N054 NE5532  ; pins In+ In- V+ V- OUT
R64 N054 N046 10k
C19 out N039 100µ
.model D D
.lib standard.dio
.model NPN NPN
.model PNP PNP
.lib standard.bjt
.include NE5532.lib
.include tip31a.lib
.include tip32a.lib
* .tran 0
.ac dec 50 1 80k
.backanno
.end